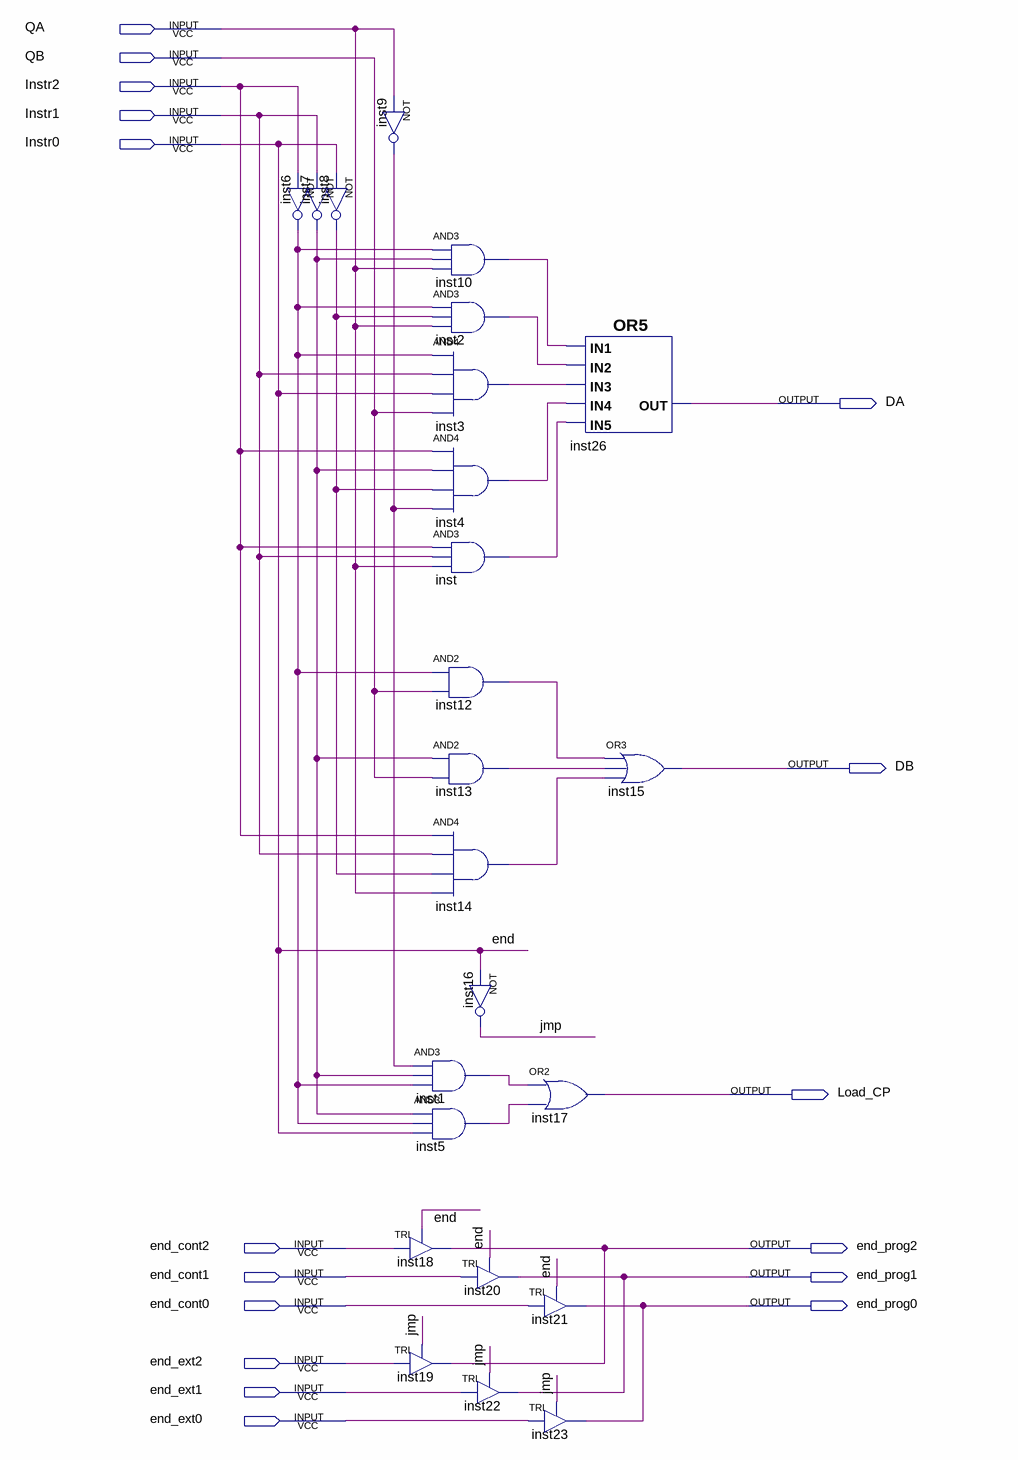
[diagram p0: schematic sheet]
// Quartus schematic decodificador3.bdf as structural Verilog: 24 symbols, 17 pins
module decodificador3 (
  input  QA,
  input  QB,
  input  Instr2,
  input  Instr1,
  input  Instr0,
  input  end_cont2,
  input  end_cont1,
  input  end_cont0,
  input  end_ext2,
  input  end_ext1,
  input  end_ext0,
  output DA,
  output DB,
  output Load_CP,
  output end_prog2,
  output end_prog1,
  output end_prog0
);

  wire inst1_out, inst2_out, inst3_out, inst4_out, inst5_out, inst6_out, inst7_out, inst8_out, inst9_out,
       inst10_out, inst12_out, inst13_out, inst14_out, inst_out, jmp;

  not inst6 (inst6_out, Instr2);
  not inst7 (inst7_out, Instr1);
  not inst9 (inst9_out, QA);
  not inst8 (inst8_out, Instr0);
  and inst10 (inst10_out, inst6_out, inst7_out, QA);
  and inst2 (inst2_out, inst6_out, inst8_out, QA);
  and inst3 (inst3_out, inst6_out, Instr1, Instr0, QB);
  and inst4 (inst4_out, Instr2, inst7_out, inst8_out, inst9_out);
  and inst (inst_out, Instr2, Instr1, QA);
  and inst12 (inst12_out, inst6_out, QB);
  and inst13 (inst13_out, inst7_out, QB);
  and inst14 (inst14_out, Instr2, Instr1, inst8_out, QA);
  not inst16 (jmp, Instr0);
  and inst1 (inst1_out, inst9_out, inst7_out, inst6_out);
  and inst5 (inst5_out, inst7_out, inst6_out, Instr0);
  TRI inst18 (.IN(end_cont2), .OE(Instr0), .OUT(end_prog2));
  TRI inst20 (.IN(end_cont1), .OE(Instr0), .OUT(end_prog1));
  TRI inst19 (.IN(end_ext2), .OE(jmp), .OUT(end_prog2));
  TRI inst22 (.IN(end_ext1), .OE(jmp), .OUT(end_prog1));
  or inst17 (Load_CP, inst1_out, inst5_out);
  TRI inst21 (.IN(end_cont0), .OE(Instr0), .OUT(end_prog0));
  TRI inst23 (.IN(end_ext0), .OE(jmp), .OUT(end_prog0));
  or inst26 (DA, inst10_out, inst2_out, inst3_out, inst4_out, inst_out);
  or inst15 (DB, inst12_out, inst13_out, inst14_out);

  // Other names for the same wires on the sheet: end = Instr0
endmodule
